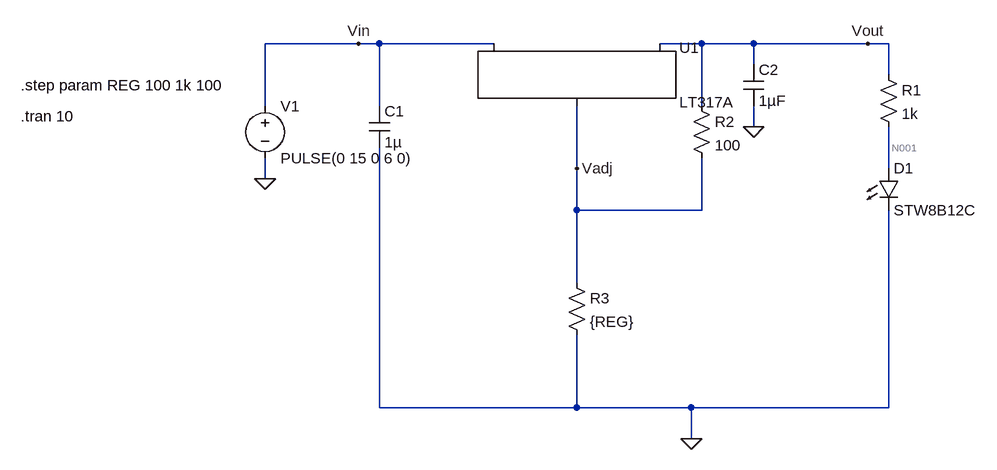
[diagram p0: schematic 3_Volt_Reg.asc]
3_Volt_Reg.asc, the LTspice schematic file:
Version 4
SHEET 1 900 744
WIRE -128 96 -272 96
WIRE -96 96 -128 96
WIRE 80 96 -96 96
WIRE 400 96 336 96
WIRE 480 96 400 96
WIRE 656 96 480 96
WIRE 688 96 656 96
WIRE 480 128 480 96
WIRE 688 144 688 96
WIRE -272 192 -272 96
WIRE -96 192 -96 96
WIRE 400 192 400 96
WIRE 480 224 480 192
WIRE 208 288 208 192
WIRE 688 288 688 224
WIRE -272 304 -272 272
WIRE 208 352 208 288
WIRE 400 352 400 272
WIRE 400 352 208 352
WIRE 208 464 208 352
WIRE -96 656 -96 256
WIRE 208 656 208 544
WIRE 208 656 -96 656
WIRE 384 656 208 656
WIRE 688 656 688 352
WIRE 688 656 384 656
WIRE 384 704 384 656
FLAG 480 224 0
FLAG 384 704 0
FLAG -272 304 0
FLAG 656 96 Vout
FLAG -128 96 Vin
FLAG 208 288 Vadj
SYMBOL PowerProducts\\LT317A 208 96 R0
SYMATTR InstName U1
SYMBOL cap -112 192 R0
SYMATTR InstName C1
SYMATTR Value 1µ
SYMATTR SpiceLine V=25
SYMBOL cap 464 128 R0
SYMATTR InstName C2
SYMATTR Value 1µF
SYMATTR SpiceLine V=25
SYMBOL res 672 128 R0
SYMATTR InstName R1
SYMATTR Value 1k
SYMATTR SpiceLine tol=5 pwr=0.25
SYMBOL res 384 176 R0
SYMATTR InstName R2
SYMATTR Value 100
SYMBOL LED 672 288 R0
SYMATTR InstName D1
SYMATTR Value STW8B12C
SYMBOL voltage -272 176 R0
WINDOW 123 0 0 Left 2
WINDOW 39 0 0 Left 2
SYMATTR InstName V1
SYMATTR Value PULSE(0 15 0 6 0)
SYMBOL res 192 448 R0
SYMATTR InstName R3
SYMATTR Value {REG}
TEXT -648 160 Left 2 !.step param REG 100 1k 100
TEXT -648 208 Left 2 !.tran 10

The netlist it stands for:
* 3_Volt_Reg.asc
XU1 Vadj Vout Vin LT317A
C1 Vin 0 1µ V=25
C2 Vout 0 1µF V=25
R1 Vout N001 1k tol=5 pwr=0.25
R2 Vout Vadj 100
D1 N001 0 STW8B12C
V1 Vin 0 PULSE(0 15 0 6 0)
R3 Vadj 0 {REG}
.model D D
.lib standard.dio
.step param REG 100 1k 100
.tran 10
.lib LTC.lib
.backanno
.end

* Results of the author's LTspice run, read from the files saved beside the schematic
* Operating Point (first step), zero values left out:
*   reg = 100 
*   V(vout) = -586.7 nV
*   V(vadj) = -293.3 nV
*   V(n001) = -586.7 nV
*   I(R3) = -2.933 nA
*   I(R2) = -2.933 nA
*   I(V1) = 2.933 nA
*   Ix(u1:2) = 2.933 nA
*   Ix(u1:3) = -2.933 nA
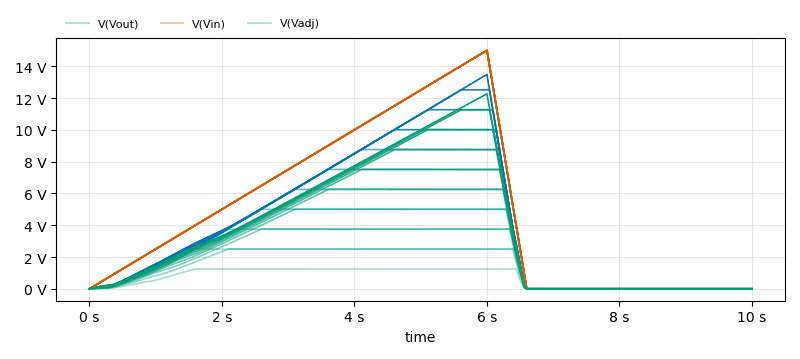
[diagram p1: Transient Analysis of 3_Volt_Reg.asc, plotted from the saved traces]
* Transient Analysis, 10 runs:
*   V(Vout) [run 1]: min -586.7 nV, max 2.5 V, average 1.371 V, rms 1.81 V, last -586.7 nV
*   V(Vout) [run 2]: min -880 nV, max 3.752 V, average 1.955 V, rms 2.62 V, last -880 nV
*   V(Vout) [run 3]: min -1.173 µV, max 5.004 V, average 2.468 V, rms 3.36 V, last -1.173 µV
*   V(Vout) [run 4]: min -1.467 µV, max 6.256 V, average 2.913 V, rms 4.026 V, last -1.467 µV
*   V(Vout) [run 5]: min -1.76 µV, max 7.508 V, average 3.287 V, rms 4.611 V, last -1.76 µV
*   V(Vout) [run 6]: min -2.053 µV, max 8.76 V, average 3.591 V, rms 5.11 V, last -2.053 µV
*   V(Vout) [run 7]: min -2.347 µV, max 10.01 V, average 3.825 V, rms 5.515 V, last -2.347 µV
*   V(Vout) [run 8]: min -2.64 µV, max 11.26 V, average 3.989 V, rms 5.813 V, last -2.64 µV
*   V(Vin) [run 1]: min 0 V, max 15 V, average 4.95 V, rms 7.629 V, last 0 V
*   V(Vin) [run 2]: min 0 V, max 15 V, average 4.95 V, rms 7.457 V, last 0 V
*   V(Vin) [run 3]: min 0 V, max 15 V, average 4.95 V, rms 7.322 V, last 0 V
*   V(Vin) [run 4]: min 0 V, max 15 V, average 4.95 V, rms 7.216 V, last 0 V
*   V(Vin) [run 5]: min 0 V, max 15 V, average 4.95 V, rms 7.14 V, last 0 V
*   V(Vin) [run 6]: min 0 V, max 15 V, average 4.95 V, rms 7.087 V, last 0 V
*   V(Vin) [run 7]: min 0 V, max 15 V, average 4.95 V, rms 7.059 V, last 0 V
*   V(Vin) [run 8]: min 0 V, max 15 V, average 4.95 V, rms 7.045 V, last 0 V
*   V(Vadj) [run 1]: min -293.3 nV, max 1.252 V, average 686.9 mV, rms 906.9 mV, last -293.3 nV
*   V(Vadj) [run 2]: min -586.7 nV, max 2.505 V, average 1.305 V, rms 1.749 V, last -586.7 nV
*   V(Vadj) [run 3]: min -880 nV, max 3.757 V, average 1.853 V, rms 2.523 V, last -880 nV
*   V(Vadj) [run 4]: min -1.173 µV, max 5.009 V, average 2.332 V, rms 3.223 V, last -1.173 µV
*   V(Vadj) [run 5]: min -1.467 µV, max 6.261 V, average 2.74 V, rms 3.845 V, last -1.467 µV
*   V(Vadj) [run 6]: min -1.76 µV, max 7.513 V, average 3.079 V, rms 4.382 V, last -1.76 µV
*   V(Vadj) [run 7]: min -2.053 µV, max 8.765 V, average 3.348 V, rms 4.827 V, last -2.053 µV
*   V(Vadj) [run 8]: min -2.347 µV, max 10.02 V, average 3.547 V, rms 5.169 V, last -2.347 µV